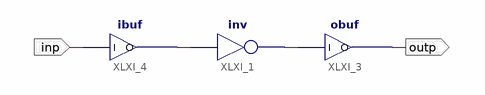
[diagram p0: schematic sheet 1]
// Xilinx ISE schematic schema.sch (spartan3) as structural Verilog: 3 symbols, 2 ports
module schema (
  input  inp,
  output outp
);

  wire XLXN_1, XLXN_2;

  not XLXI_1 (XLXN_1, XLXN_2);
  obuf XLXI_3 (.I(XLXN_1), .O(outp));
  ibuf XLXI_4 (.I(inp), .O(XLXN_2));
endmodule
